# Altium schematic sheet Sensor Interface.SchDoc
size A; SheetNumber: 1; SheetTotal: 1
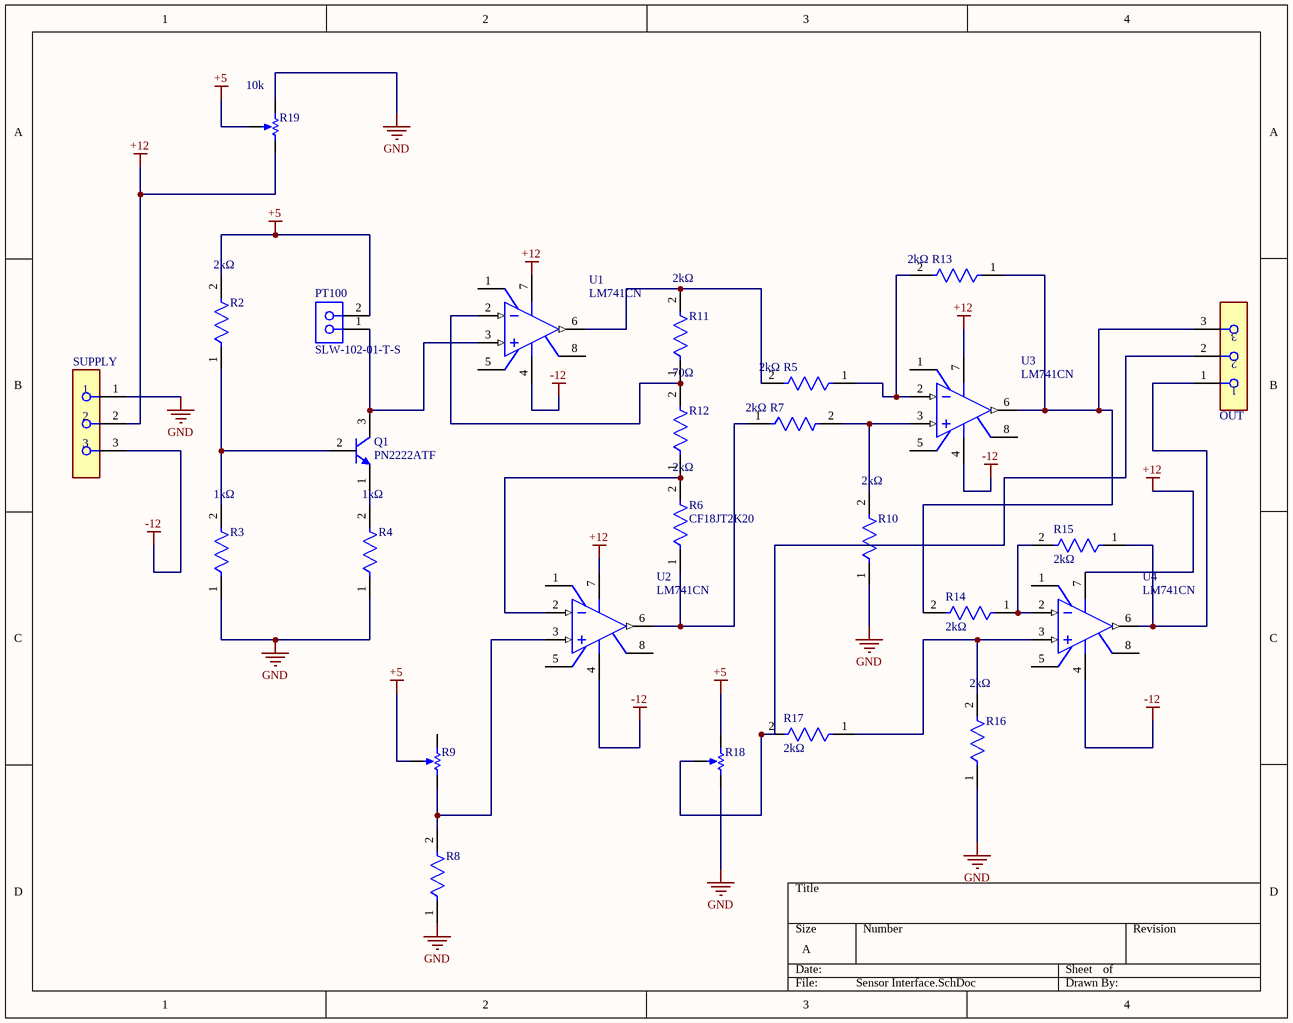
[diagram p0: Sensor Interface.SchDoc]

## Parts
OUT  SSQ-103-01-T-S  [FP-SSQ-103-01-T-S-MFG]  (value not drawn)
PT100  SLW-102-01-T-S  [SMTC-SLW-102-01-X-S]
Q1  PN2222ATF  [FAIR-TO-92-3]
R2  Resistance: 2kΩ  [FP-CF18-MFG]  (hidden comment: CF18JT2K20)
R3  Resistance: 1kΩ  [FP-CF18-MFG]  (hidden comment: CF18JT2K20)
R4  value 1kΩ  [FP-CF18-MFG]  (hidden comment: CF18JT2K20)
R5  Resistance: 2kΩ  [FP-CF18-MFG]  (hidden comment: CF18JT2K20)
R6  CF18JT2K20  Resistance: 2kΩ  [FP-CF18-MFG]
R7  Resistance: 2kΩ  [FP-CF18-MFG]  (hidden comment: CF18JT2K20)
R8  CF18JT2K20  [FP-CF18-MFG]  (value not drawn)
R9  3362P-1-104LF  [BOUR-3362P]  (value not drawn)
R10  Resistance: 2kΩ  [FP-CF18-MFG]  (hidden comment: CF18JT2K20)
R11  Resistance: 2kΩ  [FP-CF18-MFG]  (hidden comment: CF18JT2K20)
R12  Resistance: 70Ω  [FP-CF18-MFG]  (hidden comment: CF18JT2K20)
R13  Resistance: 2kΩ  [FP-CF18-MFG]  (hidden comment: CF18JT2K20)
R14  Resistance: 2kΩ  [FP-CF18-MFG]  (hidden comment: CF18JT2K20)
R15  Resistance: 2kΩ  [FP-CF18-MFG]  (hidden comment: CF18JT2K20)
R16  Resistance: 2kΩ  [FP-CF18-MFG]  (hidden comment: CF18JT2K20)
R17  Resistance: 2kΩ  [FP-CF18-MFG]  (hidden comment: CF18JT2K20)
R18  3362P-1-104LF  [BOUR-3362P]  (value not drawn)
R19  Resistance: 10k  [BOUR-3362P]  (hidden comment: 3362P-1-104LF)
SUPPLY  SSQ-103-01-T-S  [FP-SSQ-103-01-T-S-MFG]  (value not drawn)
U1  LM741CN  [N08E]
U2  LM741CN  [N08E]
U3  LM741CN  [N08E]
U4  LM741CN  [N08E]

## Nets
+5: PT100.2 R2.2 R9.2(S) R18.1(CCW) R19.2(S)
+12: R19.3(CW) SUPPLY.2 U1.7(V+) U2.7(V+) U3.7(V+) U4.7(V+)
-12: SUPPLY.3 U1.4(V-) U2.4(V-) U3.4(V-) U4.4(V-)
GND: R3.1 R4.1 R8.1 R10.1 R16.1 R18.3(CW) R19.1(CCW) SUPPLY.1
NetOUT_1: OUT.1 R15.1 U4.6(OUT)
NetOUT_2: OUT.2 R17.2 R18.2(S)
NetOUT_3: OUT.3 R13.1 R14.2 U3.6(OUT)
NetPT100_1: PT100.1 Q1.3(C) U1.3(IN+)
NetQ1_1: Q1.1(E) R4.2
NetQ1_2: Q1.2(B) R2.1 R3.2
NetR5_1: R5.1 R13.2 U3.2(IN-)
NetR5_2: R5.2 R11.2 U1.6(OUT)
NetR6_1: R6.1 R7.1 U2.6(OUT)
NetR6_2: R6.2 R12.1 U2.2(IN-)
NetR7_2: R7.2 R10.2 U3.3(IN+)
NetR8_2: R8.2 R9.3(CW) U2.3(IN+)
NetR11_1: R11.1 R12.2 U1.2(IN-)
NetR14_1: R14.1 R15.2 U4.2(IN-)
NetR16_2: R16.2 R17.1 U4.3(IN+)

Not connected (* = marked no-connect by the designer): R9 1(CCW); U1 1(OFS_NULL) 5(OFS_NULL) 8(NC); U2 1(OFS_NULL) 5(OFS_NULL) 8(NC); U3 1(OFS_NULL) 5(OFS_NULL) 8(NC); U4 1(OFS_NULL) 5(OFS_NULL) 8(NC)

## Library data of the parts
OUT SUPPLY = CMP-02766-001396-1: CONN RCPT 3POS 0.1 TIN PCB; Pitch: 2.54mm; Connector Type: Receptacle; Max Current Rating: 7.6A; Max Voltage Rating (AC): 550V; Gender: Female; Number of Positions: 3; Contact Resistance: 10mR; Length: 8.13mm; Color: Black; Packaging: Bulk; Height: 8.51mm; RoHS Compliant: Yes; Min Operating Temperature: -55°C; Contact Type: Female Socket; Number of Rows: 1; Series: SSQ; Housing Color: Black; Lead Free: Lead Free; Mount: Through Hole; Housing Material: Plastic; Contact Material: Bronze; Contact Plating: Tin; Orientation: Straight; Termination: Solder; Max Operating Temperature: 105°C; Width: 2.41mm; Radiation Hardening: No; Number of Contacts: 3
PT100 = CMP-1023-00124-1: Low Profile Socket Strips, Through-hole, Vertical, -55 to 105 degC, 2.54 mm Pitch, 2-Pin, Female, RoHS; Manufacturer: Samtec; Pitch: 2.54 mm; ComponentLink2Description: Datasheet; PackageReference: SLW-102-01-X-S; Orientation: Vertical; PartNumber: SLW-102-01-T-S; ComponentLink3URL: http://www.samtec.com/documents/webfiles/cpdf/SLW-1XX-01-X-X-MKT.pdf; DatasheetVersion: F-214; Mounting Technology: Through-hole; ComponentLink3Description: Package Specification; ComponentLink2URL: http://www.samtec.com/documents/webfiles/pdf/SLW.PDF; PackageDescription: Low Profile Socket Strip; Temperature Range: -55 to 105 degC; ComponentLink1Description: Manufacturer URL; PackageVersion: X, 9/1987; RoHS: True; ComponentLink1URL: http://www.samtec.com
Q1 = CMP-2000-06911-1: NPN General-Purpose Amplifier, 40 V, -55 to 150 degC, 3-Pin TO-92, RoHS, Tape and Reel; Manufacturer: FairchildSemiconductor; Configuration: Single; Collector-Emitter Saturation Voltage: 1V; Collector- Emitter Voltage VCEO Max: 40V; Unit Weight: 0.008466oz; Maximum DC Collector Current: 1A; DC Collector/Base Gain hfe Min: 100; Emitter- Base Voltage VEBO: 6V; Maximum Power Dissipation: 625mW; DC Current Gain hFE Max: 300; Gain Bandwidth Product fT: 300MHz; Collector- Base Voltage VCBO: 75V; Mounting Style: ThroughHole; Package Description: 3-Pin Transistor Outline Package, Body Dia 4.79 mm, Pitch 2.6 mm; Mounting Technology: ThroughHole; RoHS: Details; Brand: FairchildSemiconductor; Minimum Operating Temperature: -55C; Package / Case: TO-92-3KinkedLead; Package Reference: TO-92; Series: PN2222; Packaging: Reel; Datasheet Version: Rev. 1.1.0, 07/2014; Datasheet URL: https://www.fairchildsemi.com/datasheets/PN/PN2222A.pdf; Maximum Operating Temperature: +150C; Transistor Polarity: NPN; Factory Pack Quantity: 2000; Manufacturer URL: https://www.fairchildsemi.com/; <PCN>: http://www.mouser.com/PCN/3.26.10LTBDFairchild.pdf; Product Category: BipolarTransistors-BJT
R2 = CMP-26528-000001-1: RES 2.2K OHM 1/8W 5% CF AXIAL; Manufacturer: Stackpole Electronics Inc; Value: 2kΩ; Voltage Rating: 250V; Temperature Coefficient: 0/-400ppm/°C; Power Rating: 0.125W; Composition: Carbon Film; Octopart: https://octopart.com/cf18jt2k20-stackpole+electronics-19205714; Tolerance: 5%; Series: CF; Temperature Range Low: -55°C; ComponentLink2URL: https://www.seielect.com/catalog/sei-cf_cfm.pdf; Ipc Land Pattern Name: RESAD656W65L360D200; Package: CF18; Device Class L2: Resistors; Device Class L3: Through-Hole Resistors; Height: 2mm; Category: Res; ComponentLink2Description: Datasheet; Manufacturer Part Number: CF18JT2K20; Lead Free: Yes; Temperature Range High: +155°C; Temperature: -55°C to +155°C; RoHS: TRUE; Device Class L1: Passive Components; Digikey Description: RES 2.2K OHM 1/8W 5% CF AXIAL; Automotive: No
R3 = CMP-26528-000001-1: RES 2.2K OHM 1/8W 5% CF AXIAL; Manufacturer: Stackpole Electronics Inc; Value: 1kΩ; Voltage Rating: 250V; Temperature Coefficient: 0/-400ppm/°C; Power Rating: 0.125W; Composition: Carbon Film; Octopart: https://octopart.com/cf18jt2k20-stackpole+electronics-19205714; Tolerance: 5%; Series: CF; Temperature Range Low: -55°C; ComponentLink2URL: https://www.seielect.com/catalog/sei-cf_cfm.pdf; Ipc Land Pattern Name: RESAD656W65L360D200; Package: CF18; Device Class L2: Resistors; Device Class L3: Through-Hole Resistors; Height: 2mm; Category: Res; ComponentLink2Description: Datasheet; Manufacturer Part Number: CF18JT2K20; Lead Free: Yes; Temperature Range High: +155°C; Temperature: -55°C to +155°C; RoHS: TRUE; Device Class L1: Passive Components; Digikey Description: RES 2.2K OHM 1/8W 5% CF AXIAL; Automotive: No
R4 = CMP-26528-000001-1: RES 2.2K OHM 1/8W 5% CF AXIAL; Manufacturer: Stackpole Electronics Inc; Voltage Rating: 250V; Temperature Coefficient: 0/-400ppm/°C; Resistance: 2.2kΩ; Power Rating: 0.125W; Composition: Carbon Film; Octopart: https://octopart.com/cf18jt2k20-stackpole+electronics-19205714; Tolerance: 5%; Series: CF; Temperature Range Low: -55°C; ComponentLink2URL: https://www.seielect.com/catalog/sei-cf_cfm.pdf; Ipc Land Pattern Name: RESAD656W65L360D200; Package: CF18; Device Class L2: Resistors; Device Class L3: Through-Hole Resistors; Height: 2mm; Category: Res; ComponentLink2Description: Datasheet; Manufacturer Part Number: CF18JT2K20; Lead Free: Yes; Temperature Range High: +155°C; Temperature: -55°C to +155°C; RoHS: TRUE; Device Class L1: Passive Components; Digikey Description: RES 2.2K OHM 1/8W 5% CF AXIAL; Automotive: No
R5-R7 R10-R17 = CMP-26528-000001-1: RES 2.2K OHM 1/8W 5% CF AXIAL; Manufacturer: Stackpole Electronics Inc; Value: 2.2kΩ; Voltage Rating: 250V; Temperature Coefficient: 0/-400ppm/°C; Power Rating: 0.125W; Composition: Carbon Film; Octopart: https://octopart.com/cf18jt2k20-stackpole+electronics-19205714; Tolerance: 5%; Series: CF; Temperature Range Low: -55°C; ComponentLink2URL: https://www.seielect.com/catalog/sei-cf_cfm.pdf; Ipc Land Pattern Name: RESAD656W65L360D200; Package: CF18; Device Class L2: Resistors; Device Class L3: Through-Hole Resistors; Height: 2mm; Category: Res; ComponentLink2Description: Datasheet; Manufacturer Part Number: CF18JT2K20; Lead Free: Yes; Temperature Range High: +155°C; Temperature: -55°C to +155°C; RoHS: TRUE; Device Class L1: Passive Components; Digikey Description: RES 2.2K OHM 1/8W 5% CF AXIAL; Automotive: No
R8 = CMP-26528-000001-1: RES 2.2K OHM 1/8W 5% CF AXIAL; Manufacturer: Stackpole Electronics Inc; Value: 2.2kΩ; Voltage Rating: 250V; Temperature Coefficient: 0/-400ppm/°C; Resistance: 10kΩ; Power Rating: 0.125W; Composition: Carbon Film; Octopart: https://octopart.com/cf18jt2k20-stackpole+electronics-19205714; Tolerance: 5%; Series: CF; Temperature Range Low: -55°C; ComponentLink2URL: https://www.seielect.com/catalog/sei-cf_cfm.pdf; Ipc Land Pattern Name: RESAD656W65L360D200; Package: CF18; Device Class L2: Resistors; Device Class L3: Through-Hole Resistors; Height: 2mm; Category: Res; ComponentLink2Description: Datasheet; Manufacturer Part Number: CF18JT2K20; Lead Free: Yes; Temperature Range High: +155°C; Temperature: -55°C to +155°C; RoHS: TRUE; Device Class L1: Passive Components; Digikey Description: RES 2.2K OHM 1/8W 5% CF AXIAL; Automotive: No
R9 = CMP-1747-00003-1: Square Trimpot(R) Trimming Potentiometer, 100 KOhm, 300 V, -55 to 125 degC, 3-Pin THD, RoHS, Tube; Voltage Rating: 250 V; Case\Package: Axial; Tolerance: 1%; Power Rating: 250 mW; Resistance: 500; RoHSCompliant: true; ComponentLink2URL: http://www.bourns.com/docs/Product-Datasheets/3362.pdf; ComponentLink1Description: Manufacturer URL; DatasheetVersion: May-16; Package Quantity: 200; ComponentLink2Description: Datasheet; Min Operating Temperature: -55 degC; Mount: Through Hole; PackageDescription: 3-Pin Through Hole Device, Body 6.6 x 6.99 mm, Pitch 2.54 mm; Length: 0.248 inch; ComponentLink1URL: http://www.bourns.com/; PackageReference: 3326P; Max Operating Temperature: 155 degC; Packaging: Bulk
R18 = CMP-1747-00003-1: Square Trimpot(R) Trimming Potentiometer, 100 KOhm, 300 V, -55 to 125 degC, 3-Pin THD, RoHS, Tube; Voltage Rating: 250 V; Case\Package: Axial; Tolerance: 1%; Power Rating: 250 mW; Resistance: 1 mohm; RoHSCompliant: true; ComponentLink2URL: http://www.bourns.com/docs/Product-Datasheets/3362.pdf; ComponentLink1Description: Manufacturer URL; DatasheetVersion: May-16; Package Quantity: 200; ComponentLink2Description: Datasheet; Min Operating Temperature: -55 degC; Mount: Through Hole; PackageDescription: 3-Pin Through Hole Device, Body 6.6 x 6.99 mm, Pitch 2.54 mm; Length: 0.248 inch; ComponentLink1URL: http://www.bourns.com/; PackageReference: 3326P; Max Operating Temperature: 155 degC; Packaging: Bulk
R19 = CMP-1747-00003-1: Square Trimpot(R) Trimming Potentiometer, 100 KOhm, 300 V, -55 to 125 degC, 3-Pin THD, RoHS, Tube; Voltage Rating: 250 V; Case\Package: Axial; Tolerance: 1%; Power Rating: 250 mW; RoHSCompliant: true; ComponentLink2URL: http://www.bourns.com/docs/Product-Datasheets/3362.pdf; ComponentLink1Description: Manufacturer URL; DatasheetVersion: May-16; Package Quantity: 200; ComponentLink2Description: Datasheet; Min Operating Temperature: -55 degC; Mount: Through Hole; PackageDescription: 3-Pin Through Hole Device, Body 6.6 x 6.99 mm, Pitch 2.54 mm; Length: 0.248 inch; ComponentLink1URL: http://www.bourns.com/; PackageReference: 3326P; Max Operating Temperature: 155 degC; Packaging: Bulk
U1-U4 = CMP-0055-00155-2: Operational Amplifier, 8-pin MDIP; Manufacturer: National Semiconductor; PowerWise: N; CompType: Amplifiers; PackageTopMarking: NSUZXYTTE#*LM*741CN; PackageVersion: revG, May-2006; Code_JEDEC: MS-001-BA; RoHS: N; ComponentLink2URL: http://www.national.com/pf/LM/LM741.html; ComponentLink3Description: N08E Package Page; PackageReference: N08E; ComponentLink1Description: LM741 Datasheet; PinCount: 8; ComponentLink1URL: http://www.national.com/ds/LM/LM741.pdf; ComponentLink2Description: LM741 Web Page; DatasheetVersion: Aug-2000; PackageDescription: MDIP, .365 x .250 x .130in, 8 Lead, .100in Pitch; RevisionNote: Component URLs added; ComponentLink3URL: http://www.national.com/packaging/folders/n08e.html